# EAGLE design 20140624_empfÃ¤nger_567_frÃ¤se_v2 (EAGLE 6.4)
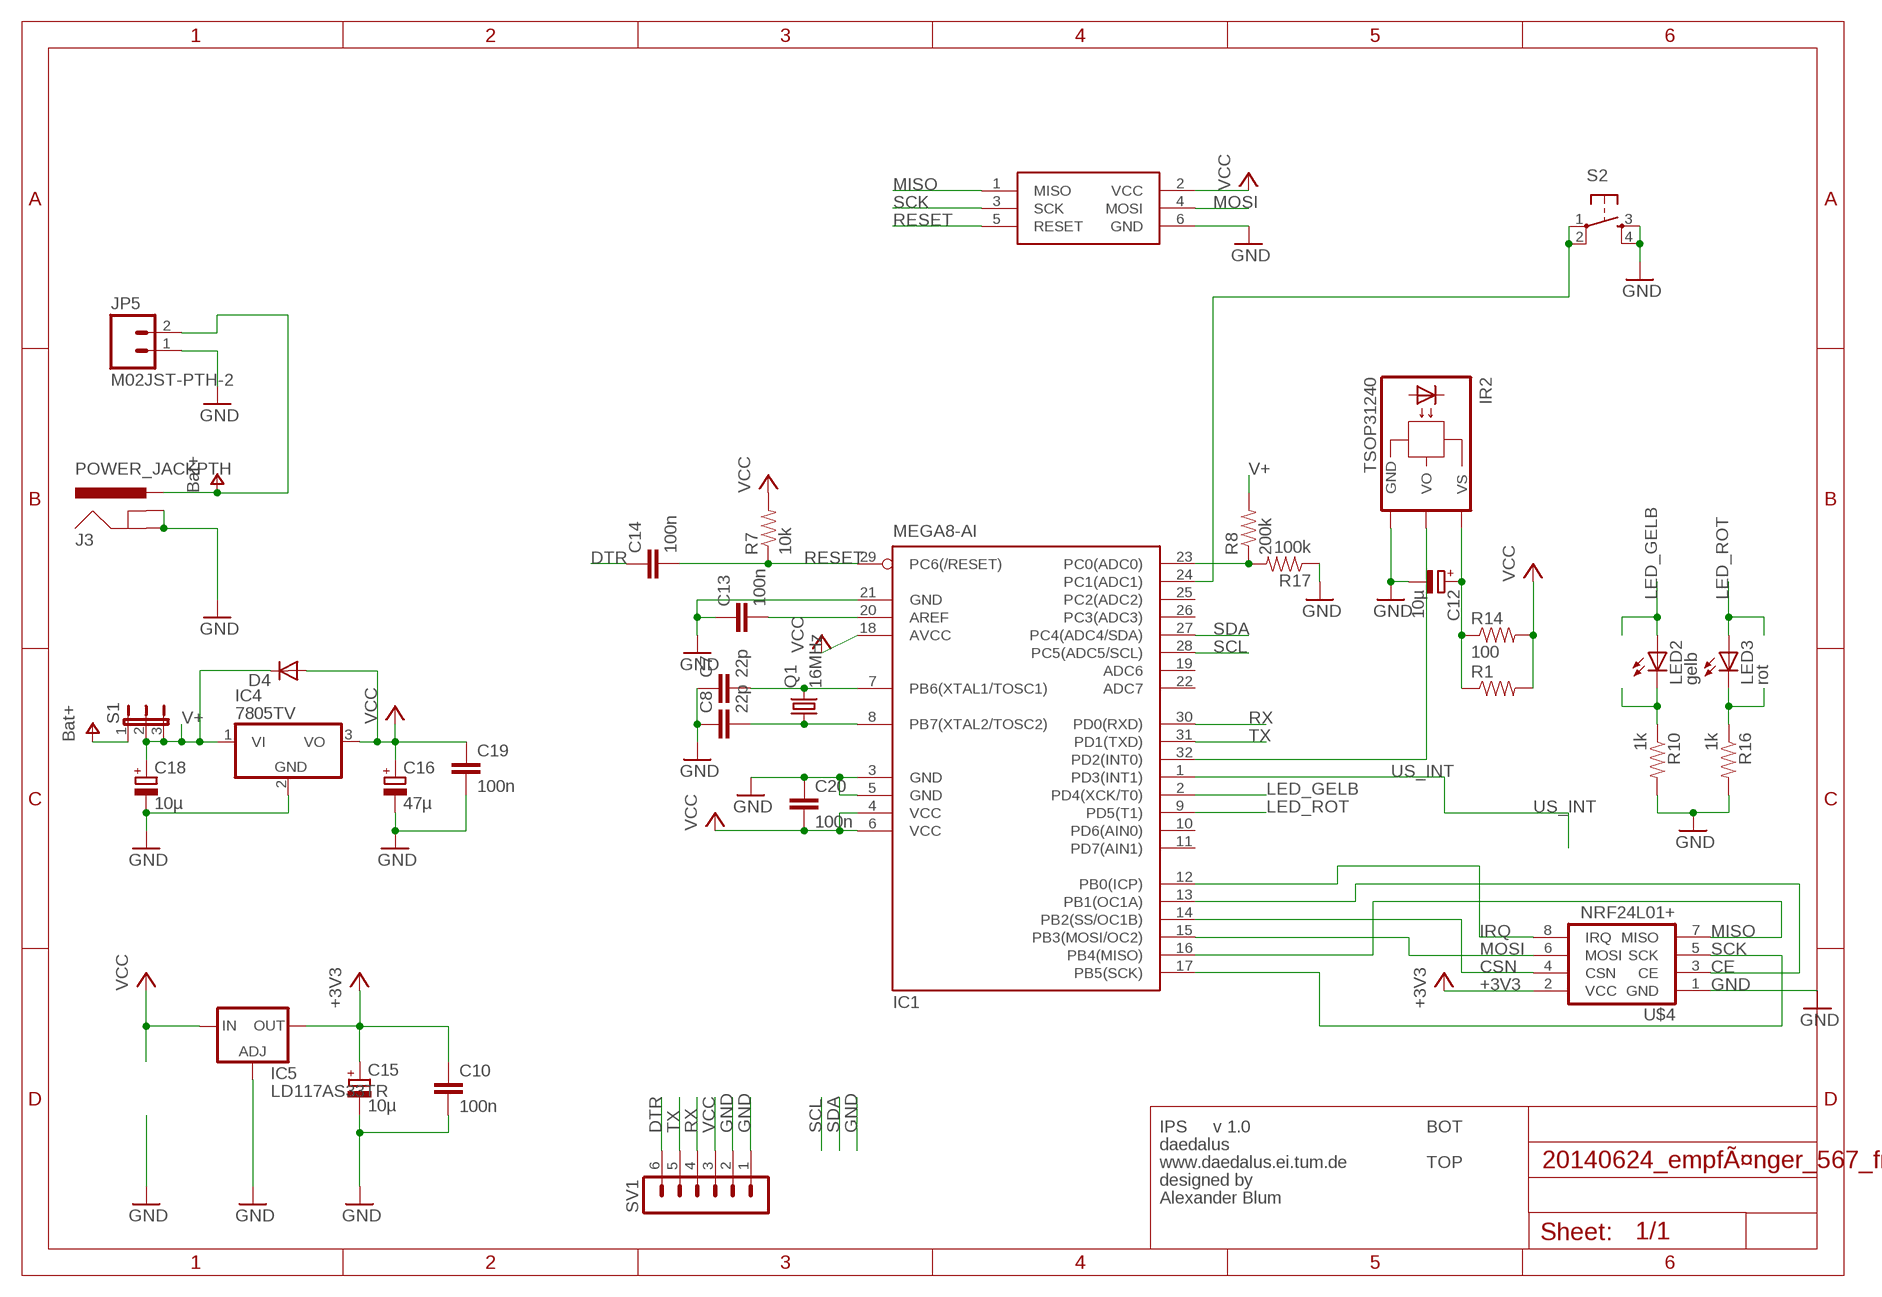
[diagram p0: schematic, sheet 1, part 1 of 2]
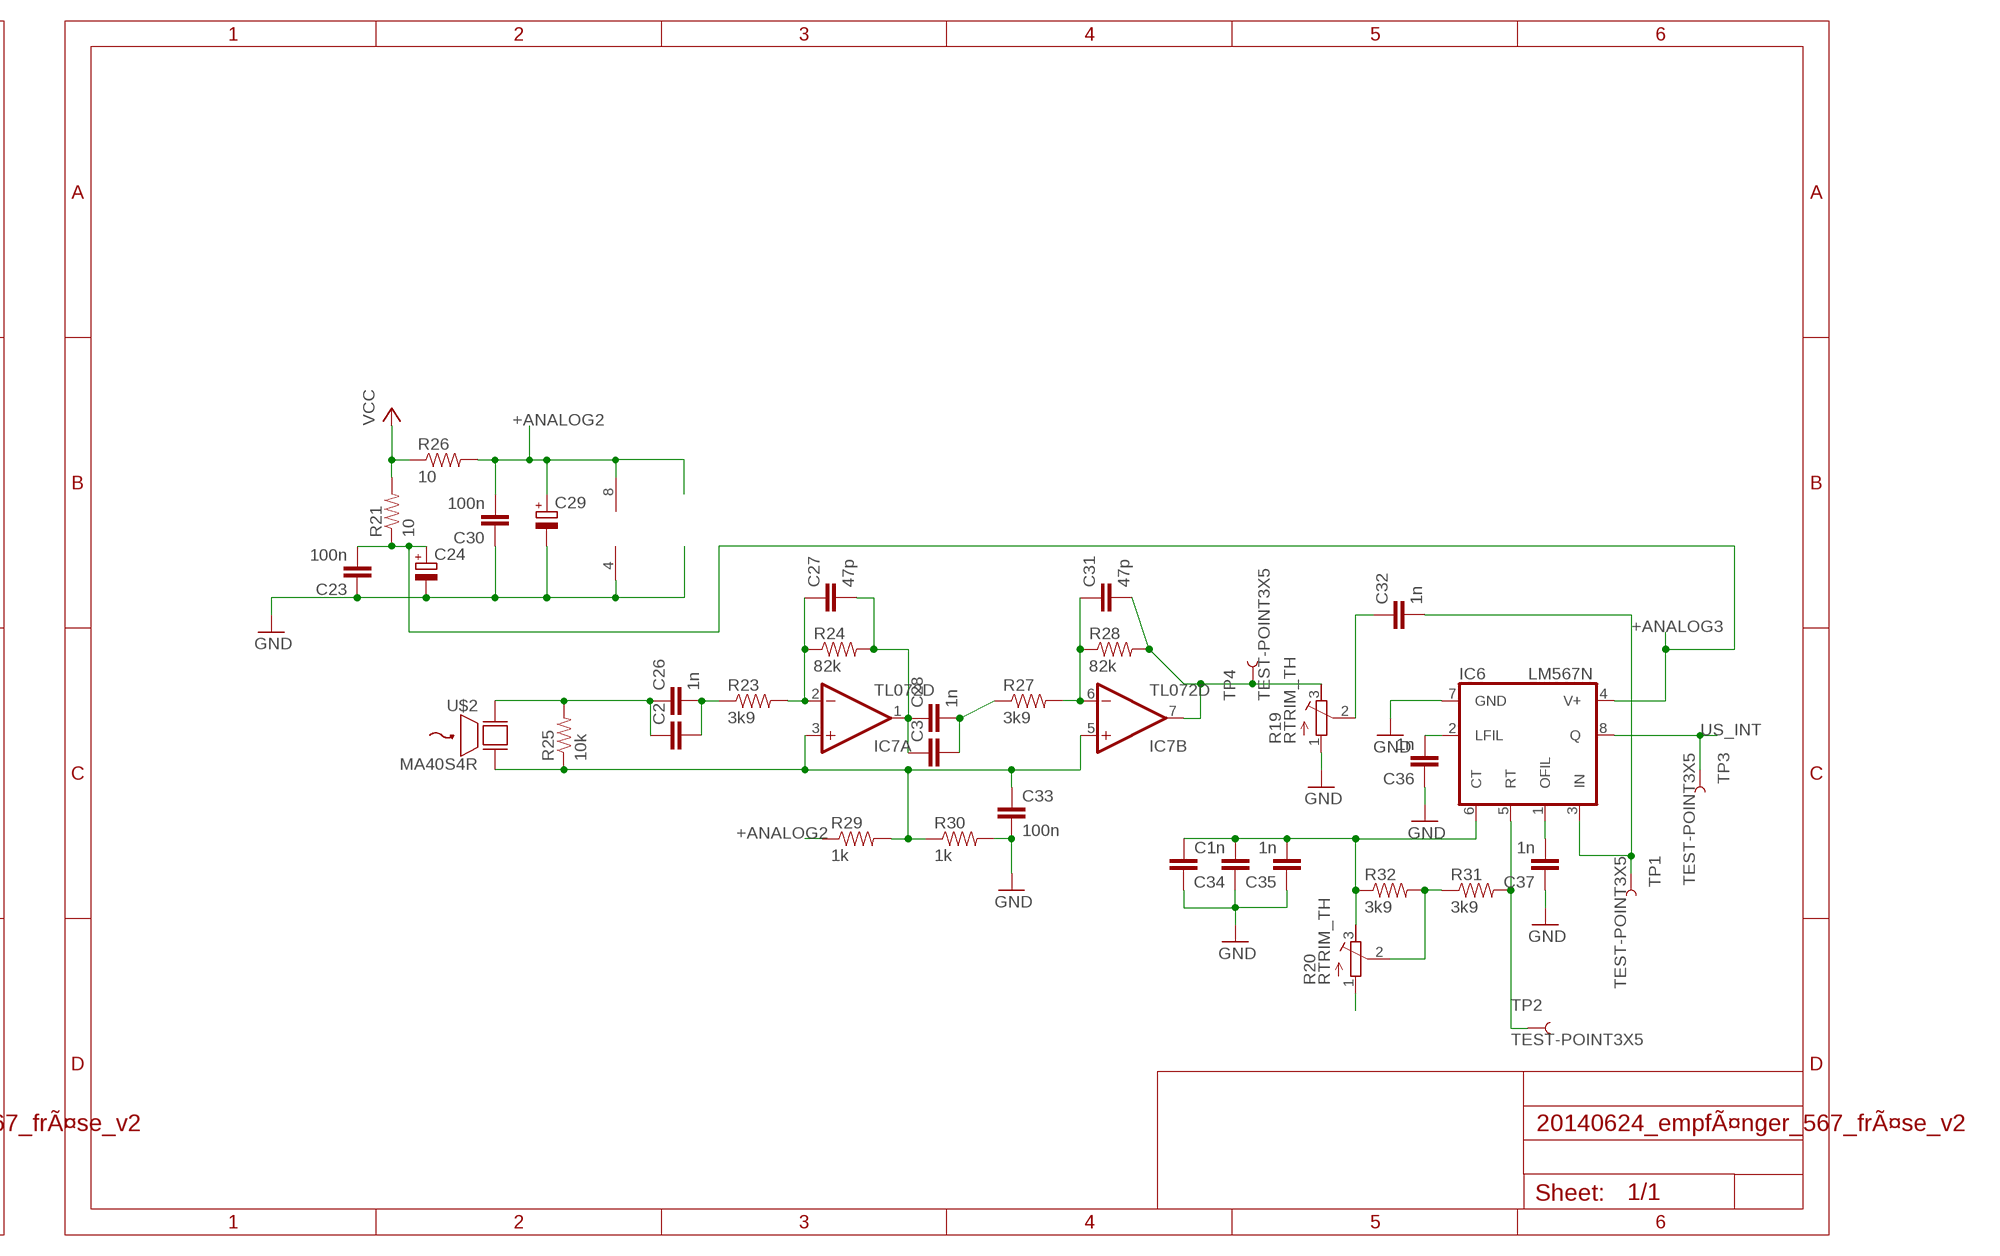
[diagram p1: schematic, sheet 1, part 2 of 2]

## Parts
C1  CAP1206  [1206]
C2  CAP1206  [1206]
C3  CAP1206  [1206]
C7  22p  CAP0805  [0805]
C8  22p  CAP0805  [0805]
C10  100n  CAP0805  [0805]
C12  10µ  CPOL-EUE2.5-5  [E2,5-5]
C13  100n  CAP0805  [0805]
C14  100n  CAP0805  [0805]
C15  10µ  CPOL-EUE2.5-5  [E2,5-5]
C16  47µ  CPOL-EUE2.5-5  [E2,5-5]
C18  10µ  CPOL-EUE2.5-5  [E2,5-5]
C19  100n  CAP0805  [0805]
C20  100n  CAP0805  [0805]
C23  100n  CAP0805  [0805]
C24  CPOL-EUE2.5-5  [E2,5-5]
C26  1n  CAP0805  [0805]
C27  47p  CAP0805  [0805]
C28  1n  CAP0805  [0805]
C29  CPOL-EUE2.5-5  [E2,5-5]
C30  100n  CAP0805  [0805]
C31  47p  CAP0805  [0805]
C32  1n  CAP0805  [0805]
C33  100n  CAP0805  [0805]
C34  1n  CAP0805  [0805]
C35  1n  CAP0805  [0805]
C36  1n  CAP0805  [0805]
C37  1n  CAP0805  [0805]
D4  DIODE-MINIMELF  [MINIMELF]
IC1  MEGA8-AI  [TQFP32-08]
IC4  7805TV  [TO220V]
IC5  LD117AS33TR  [SOT223]
IC6  LM567N  [DIL08]
IC7  TL072D  [SO08]
IR2  TSOP31240  [TSOP31240]
J3  POWER_JACKPTH  [POWER_JACK_PTH]
JP5  M02JST-PTH-2  [JST-2-PTH]
LED2  gelb  LED5MM  [LED5MM]
LED3  rot  LED5MM  [LED5MM]
Q1  16MHz  CRYSTALHC49S  [HC49/S]
R1  RESISTOR1206  [1206]
R7  10k  RESISTOR0805-RES  [0805]
R8  200k  RESISTOR0805-RES  [0805]
R10  1k  RESISTOR0805-RES  [0805]
R14  100  RESISTOR0805-RES  [0805]
R16  1k  RESISTOR0805-RES  [0805]
R17  100k  RESISTOR0805-RES  [0805]
R19  RTRIM_TH  [RTRIM_TH]
R20  RTRIM_TH  [RTRIM_TH]
R21  10  RESISTOR0805-RES  [0805]
R23  3k9  RESISTOR0805-RES  [0805]
R24  82k  RESISTOR0805-RES  [0805]
R25  10k  RESISTOR0805-RES  [0805]
R26  10  RESISTOR0805-RES  [0805]
R27  3k9  RESISTOR0805-RES  [0805]
R28  82k  RESISTOR0805-RES  [0805]
R29  1k  RESISTOR0805-RES  [0805]
R30  1k  RESISTOR0805-RES  [0805]
R31  3k9  RESISTOR0805-RES  [0805]
R32  3k9  RESISTOR0805-RES  [0805]
S1  JP2E  [JP2]
S2  TAC_SWITCHPTH  [TACTILE-PTH]
SV1  MA06-1  [MA06-1]
TP1  TEST-POINT3X5  [PAD.03X.05]
TP2  TEST-POINT3X5  [PAD.03X.05]
TP3  TEST-POINT3X5  [PAD.03X.05]
TP4  TEST-POINT3X5  [PAD.03X.05]
U$2  MA40S4R  [MUS40]
U$3  ISP_HEADER  [ISP_HEADER]
U$4  NRF24L01+  [NRF24]

## Nets
+3V3: C10.1 C15.+ IC5.4(OUT) U$4.2(VCC)
+ANALOG2: C29.+ C30.2 IC7.8(P:V+) R26.2 R29.1
+ANALOG3: C23.2 C24.+ IC6.4(V+) R21.1
BAT+: J3.PWR JP5.2 S1.1 ; supply symbol labelled Bat+
CE: IC1.13(PB1(OC1A)) U$4.3(CE)
CSN: IC1.14(PB2(SS/OC1B)) U$4.4(CSN)
DTR: C14.1 SV1.6
GND: C1.2 C7.1 C8.1 C10.2 C12.- C13.1 C15.- C16.- C18.- C19.2 C20.1 C23.1 C24.- C29.- C30.1 C33.2 C34.1 C35.1 C36.1 C37.1 IC1.3(GND) IC1.5(GND) IC1.21(GND) IC4.2(GND) IC5.1(ADJ) IC6.7(GND) IC7.4(P:V-) IR2.GND J3.GND J3.GNDBREAK JP5.1 R10.2 R16.2 R17.1 R19.1(E) R30.2 S2.3 S2.4 SV1.1 SV1.2 U$3.6(GND) U$4.1(GND)
IRQ: IC1.12(PB0(ICP)) U$4.8(IRQ)
LED_GELB: IC1.2(PD4(XCK/T0)) LED2.A
LED_ROT: IC1.9(PD5(T1)) LED3.A
MISO: IC1.16(PB4(MISO)) U$3.1(MISO) U$4.7(MISO)
MOSI: IC1.15(PB3(MOSI/OC2)) U$3.4(MOSI) U$4.6(MOSI)
N$12: C7.2 IC1.7(PB6(XTAL1/TOSC1)) Q1.2
N$14: C12.+ IR2.VS R1.1 R14.1
N$15: C8.2 IC1.8(PB7(XTAL2/TOSC2)) Q1.1
N$16: IC1.23(PC0(ADC0)) R8.1 R17.2
N$18: IC1.32(PD2(INT0)) IR2.VO
N$20: R20.2(S) R31.1 R32.2
N$21: C13.2 IC1.20(AREF)
N$26: LED2.K(C) R10.1
N$27: LED3.K(C) R16.1
N$32: C2.2 C26.2 R23.1
N$33: C27.1 IC7.2(A:-IN) R23.2 R24.1
N$34: C3.1 C27.2 C28.1 IC7.1(A:OUT) R24.2
N$35: C3.2 C28.2 R27.1
N$36: C2.1 C26.1 R25.2 U$2.2
N$37: IC6.5(RT) R31.2 TP2.P$1
N$39: C33.1 IC7.3(A:+IN) IC7.5(B:+IN) R25.1 R29.2 R30.1 U$2.1
N$40: IC1.24(PC1(ADC1)) S2.1 S2.2
N$41: C31.1 IC7.6(B:-IN) R27.2 R28.1
N$43: C1.1 C34.2 C35.2 IC6.6(CT) R20.3(A) R32.1
N$44: C31.2 IC7.7(B:OUT) R19.3(A) R28.2 TP4.P$1
N$45: C32.1 R19.2(S)
N$46: C32.2 IC6.3(IN) TP1.P$1
N$47: C37.2 IC6.1(OFIL)
N$49: C36.2 IC6.2(LFIL)
N$65: R20.1(E)
RESET: C14.2 IC1.29(PC6(/RESET)) R7.1 U$3.5(RESET)
RX: IC1.30(PD0(RXD)) SV1.4
SCK: IC1.17(PB5(SCK)) U$3.3(SCK) U$4.5(SCK)
SCL: IC1.28(PC5(ADC5/SCL))
SDA: IC1.27(PC4(ADC4/SDA))
TX: IC1.31(PD1(TXD)) SV1.5
US_INT: IC1.1(PD3(INT1)) IC6.8(Q) TP3.P$1
V+: C18.+ D4.C IC4.1(VI) R8.2 S1.2 S1.3
VCC: C16.+ C19.1 C20.2 D4.A IC1.4(VCC) IC1.6(VCC) IC1.18(AVCC) IC4.3(VO) IC5.3(IN) R1.2 R7.2 R14.2 R21.2 R26.1 SV1.3 U$3.2(VCC)
Unconnected: IC1.10(PD6(AIN0)) IC1.11(PD7(AIN1)) IC1.19(ADC6) IC1.22(ADC7) IC1.25(PC2(ADC2)) IC1.26(PC3(ADC3))

## Notes on the sheet
- IPS | v 1.0 | BOT
- daedalus
- www.daedalus.ei.tum.de | TOP
- designed by
- Alexander Blum

## Library data of the parts
C1-C3 C7 C8 C10 C13 C14 C19 C20 C23 C26-C28 C30-C37 = SparkFun-Passives:CAP: Capacitor Standard 0603 ceramic capacitor, and 0.1" leaded capacitor.
C12 C15 C16 C18 C24 C29 = resistor:CPOL-EU: POLARIZED CAPACITOR, European symbol
D4 = diode:DIODE-: DIODE
IC1 = atmel:MEGA8: MICROCONTROLLER 8 Kbytes FLASH, 1 kbytes SRAM, 512 bytes EEPROM, USART, 6-channel 10 bit ADC, 2-channel 8 bit ADC Pin compatible with Atmega48, ATMega88, ATMega168 Source: avr.lbr; MPN: ATMEGA8-16AU; OC_FARNELL: 9171371; OC_NEWARK: 73M8863
IC4 = linear:78*: Positive VOLTAGE REGULATOR Source: http://cache.national.com/ds/LM/LM78L05.pdf http://www.fairchildsemi.com/ds/LM/LM7805.pdf
IC5 = v-reg:LD117A?*: Low drop fixed and adjustable positive voltage regulators 1 A Source: http://www.st.com/stonline/products/literature/ds/7194/ld1117axx.pdf
IC6 = linear:*567: TONE DECODER
IC7 = linear:TL072: OP AMP
IR2 = Alex_daedalus_ips:TSOP312: TSOP17..TB1 IR Receiver Modules for Remote Control Systems Source: http://www.vishay.com/docs/82042/82042.pdf; OC_FARNELL: unknown; OC_NEWARK: unknown
J3 = SparkFun-Connectors:POWER_JACK: Power Jack This is the standard 5.5mm barrel jack for power. The PTH is the most common, proven, reliable, footprint. The Slot footprint only works if the mill layer is transmitted to the PCB fab house so be warned. Mating wall wart : TOL-00298 (and others); PROD_ID: PRT-00119
JP5 = SparkFun-Connectors:M02: Standard 2-pin 0.1" header. Use with - straight break away headers ( PRT-00116) - right angle break away headers (PRT-00553) - swiss pins (PRT-00743) - machine pins (PRT-00117) - female headers (PRT-00115) Molex polarized connector foot print use with: PRT-08233 with associated crimp pins and housings. 2.54_SCREWTERM for use with PRT-10571. 3.5mm Screw Terminal footprints for PRT-08084 5mm Screw Terminal footprints for use with PRT-08433; SKU: PRT-09914
LED2 LED3 = led:LED: LED OSRAM: - CHIPLED LG R971, LG N971, LY N971, LG Q971, LY Q971, LO R971, LY R971 LH N974, LH R974 LS Q976, LO Q976, LY Q976 LO Q996 - Hyper CHIPLED LW Q18S LB Q993, LB Q99A, LB R99A - SideLED LS A670, LO A670, LY A670, LG A670, LP A670 LB A673, LV A673, LT A673, LW A673 LH A674 LY A675 LS A676, LA A676, LO A676, LY A676, LW A676 LS A679, LY A679, LG A679 - Hyper Micro SIDELED® LS Y876, LA Y876, LO Y876, LY Y876 LT Y87S - SmartLED LW L88C, LW L88S LB L89C, LB L89S, LG L890 LS L89K, LO L89K, LY L89K LS L896, LA L896, LO L896, LY L896 - TOPLED LS T670, LO T670, LY T670, LG T670, LP T670 LSG T670, LSP T670, LSY T670, LOP T670, LYG T670 LG T671, LOG T671, LSG T671 LB T673, LV T673, LT T673, LW T673 LH T674 LS T676, LA T676, LO T676, LY T676, LB T676, LH T676, LSB T676, LW T676 LB T67C, LV T67C, LT T67C, LS T67K, LO T67K, LY T67K, LW E67C LS E67B, LA E67B, LO E67B, LY E67B, LB E67C, LV E67C, LT E67C LW T67C LS T679, LY T679, LG T679 LS T770, LO T770, LY T770, LG T770, LP T770 LB T773, LV T773, LT T773, LW T773 LH T774 LS E675, LA E675, LY E675, LS T675 LS T776, LA T776, LO T776, LY T776, LB T776 LHGB T686 LT T68C, LB T68C - Hyper Mini TOPLED® LB M676 - Mini TOPLED Santana® LG M470 LS M47K, LO M47K, LY M47K Source: http://www.osram.convergy.de LUXEON: - LUMILED® LXK2-PW12-R00, LXK2-PW12-S00, LXK2-PW14-U00, LXK2-PW14-V00 LXK2-PM12-R00, LXK2-PM12-S00, LXK2-PM14-U00 LXK2-PE12-Q00, LXK2-PE12-R00, LXK2-PE12-S00, LXK2-PE14-T00, LXK2-PE14-U00 LXK2-PB12-K00, LXK2-PB12-L00, LXK2-PB12-M00, LXK2-PB14-N00, LXK2-PB14-P00, LXK2-PB14-Q00 LXK2-PR12-L00, LXK2-PR12-M00, LXK2-PR14-Q00, LXK2-PR14-R00 LXK2-PD12-Q00, LXK2-PD12-R00, LXK2-PD12-S00 LXK2-PH12-R00, LXK2-PH12-S00 LXK2-PL12-P00, LXK2-PL12-Q00, LXK2-PL12-R00 Source: www.luxeon.com KINGBRIGHT: KA-3528ASYC Source: www.kingbright.com
Q1 = crystal:CRYSTAL: CRYSTAL; OC_FARNELL: 1667008; OC_NEWARK: unknown
R1 R7 R8 R10 R14 R16 R17 R21 R23-R32 = SparkFun-Passives:RESISTOR: Resistor Basic schematic elements and footprints for 0603, 1206, and PTH resistors.
R19 R20 = Alex_daedalus_ips:RTRIM_TH
S1 = jumper:JP2E: JUMPER
S2 = SparkFun-Electromechanical:TAC_SWITCH: Momentary Switch Button commonly used for reset or general input. Spark Fun Electronics SKU : COM-00097 SMT- SWCH-08247
SV1 = con-lstb:MA06-1: PIN HEADER; OC_FARNELL: unknown; OC_NEWARK: unknown
TP1-TP4 = SparkFun-Passives:TEST-POINT: Bare copper test points for troubleshooting or ICT
U$2 = Alex_daedalus_ips:MA40S4R
U$3 = Alex_daedalus_ips:ISP_HEADER
U$4 = Alex_daedalus_ips:NRF24L01+

## Board
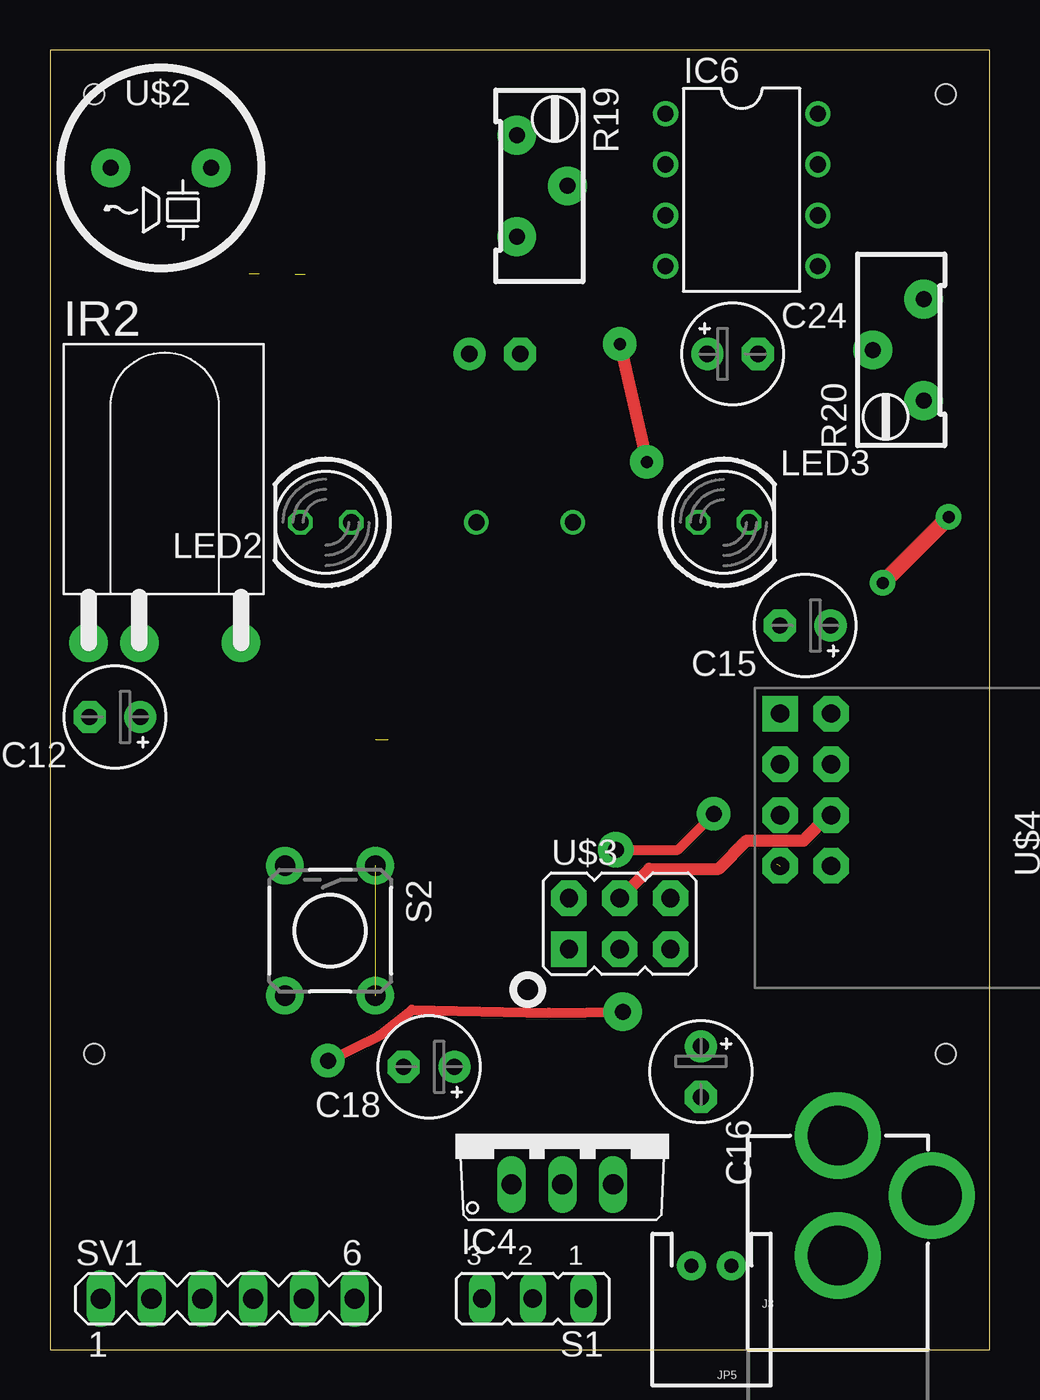
[diagram p2: board, top side]
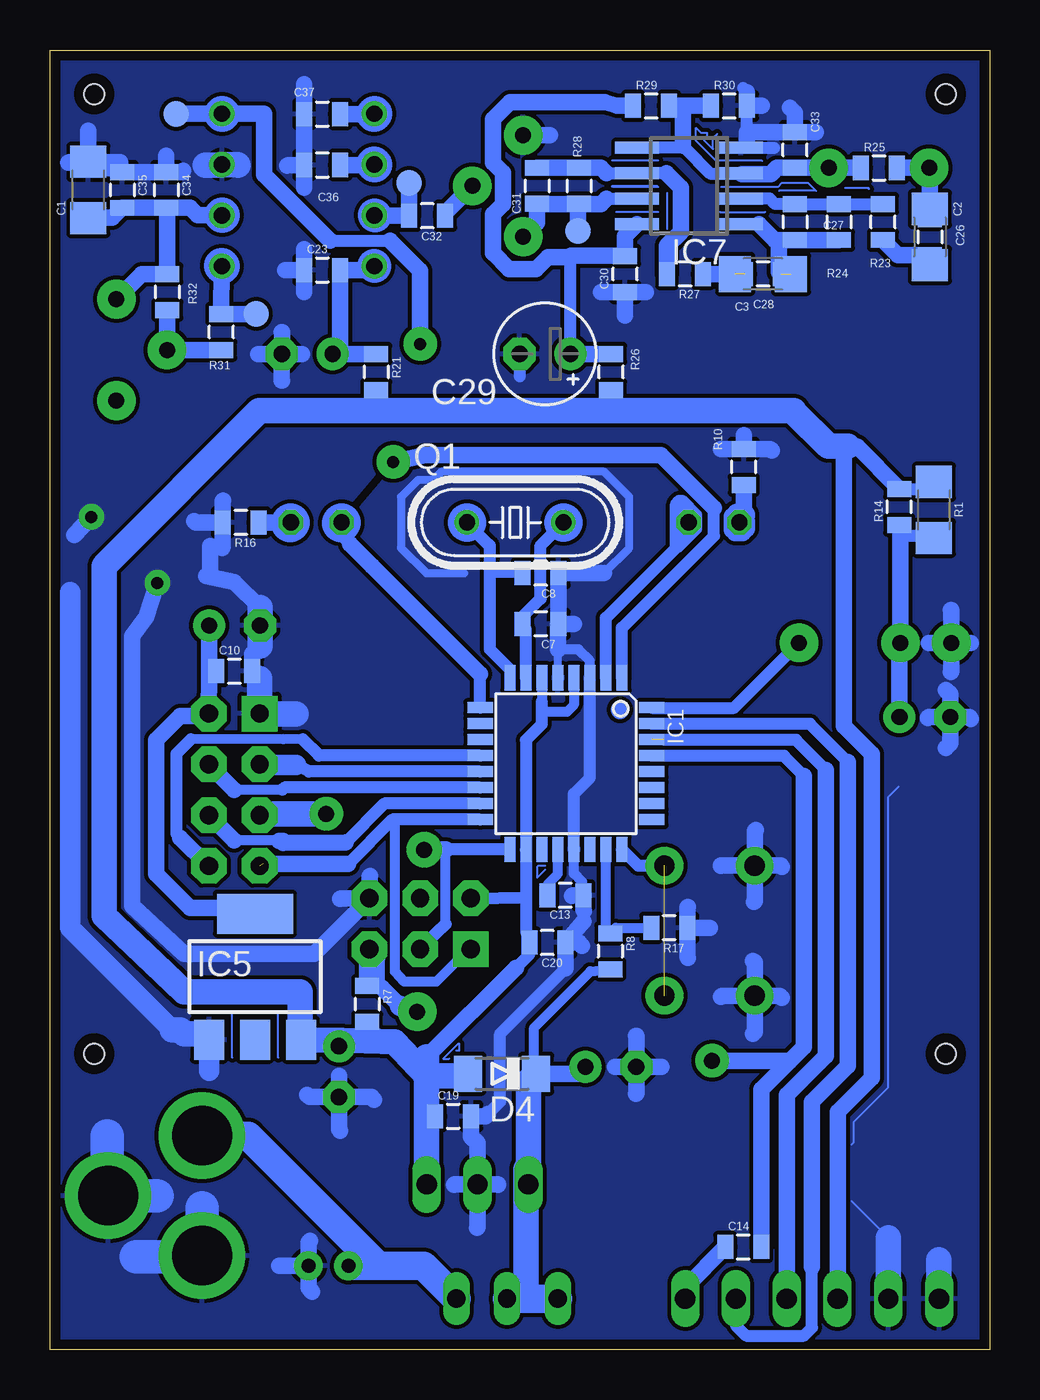
[diagram p3: board, bottom side, seen from below]

Size 47 x 65 mm. Coordinates in mm from the lower left corner, seen from the top.
Outline: 0,0 47,0 47,65 0,65 0,0
Copper layers (1*16): Top 0.07mm / dielectric 1.5mm / Bottom 0.07mm
Design rules "multi-cb_070um-cu *": minimum track width 8mil, minimum drill 12mil, track to track 4mil, track to pad 8mil, pad to pad 8mil, via to via 8mil, smd to smd 8mil, copper to edge 20mil, drill to drill 8mil, minimum pad ring 8mil, minimum via ring 6mil, stop-mask expansion 3mil, vias tented up to drill 0mil, thermal gap 8mil
Holes 1 mm at 2.2,62.8 44.8,62.8 44.8,14.8 2.2,14.8
bRestrict: 2 lines

### Footprints (pad centres in the part's own frame; a part is rotated, then mirrored left to right if it is on the bottom)
1206 = smd 1.6 x 1.8: 1 -1.4,0; 2 1.4,0
0805 = smd 0.8 x 1.2: 1 -0.9,0; 2 0.9,0
E2,5-5 = drill 0.813 pad 1.6: + -1.27,0 | drill 0.813 pad 1.6 octagon: - 1.27,0
MINIMELF = smd 1.4 x 1.8: A 1.7,0; C -1.7,0
TQFP32-08 = smd 1.27 x 0.559: 1 -4.293,2.8; 2 -4.293,2; 3 -4.293,1.2; 4 -4.293,0.4; 5 -4.293,-0.4; 6 -4.293,-1.2; 7 -4.293,-2; 8 -4.293,-2.8; 17 4.293,-2.8; 18 4.293,-2; 19 4.293,-1.2; 20 4.293,-0.4; 21 4.293,0.4; 22 4.293,1.2; 23 4.293,2; 24 4.293,2.8 | smd 0.559 x 1.27: 9 -2.8,-4.293; 10 -2,-4.293; 11 -1.2,-4.293; 12 -0.4,-4.293; 13 0.4,-4.293; 14 1.2,-4.293; 15 2,-4.293; 16 2.8,-4.293; 25 2.8,4.293; 26 2,4.293; 27 1.2,4.293; 28 0.4,4.293; 29 -0.4,4.293; 30 -1.2,4.293; 31 -2,4.293; 32 -2.8,4.293
TO220V = drill 1.016 long: 1 -2.54,-2.54; 2 0,-2.54; 3 2.54,-2.54
SOT223 = smd 1.5 x 2: 1 -2.3,-3.15; 2 0,-3.15; 3 2.3,-3.15 | smd 3.8 x 2: 4 0,3.15
DIL08 = drill 0.813 pad 1.27: 1 -3.81,-3.81; 2 -1.27,-3.81; 3 1.27,-3.81; 4 3.81,-3.81; 5 3.81,3.81; 6 1.27,3.81; 7 -1.27,3.81; 8 -3.81,3.81
SO08 = smd 0.6 x 2.2: 1 -1.905,-2.6; 2 -0.635,-2.6; 3 0.635,-2.6; 4 1.905,-2.6; 5 1.905,2.6; 6 0.635,2.6; 7 -0.635,2.6; 8 -1.905,2.6
TSOP31240 = drill 0.8 pad 1.93: GND 2.54,1.27; VO 10.16,1.27; VS 5.08,1.27
POWER_JACK_PTH = drill 2.997 pad 4.318: GND 0,7.7; GNDBREAK 4.7,10.7; PWR 0,13.7
JST-2-PTH = drill 0.7 pad 1.448: 1 -1,0; 2 1,0
LED5MM = drill 0.813 octagon: A -1.27,0; K 1.27,0
HC49/S = drill 0.813: 1 -2.413,0; 2 2.413,0
RTRIM_TH = drill 0.8 pad 1.93: 1 0,-2.54; 2 -2.54,0; 3 0,2.54
JP2 = drill 0.914 long: 1 -2.54,0; 2 0,0; 3 2.54,0
TACTILE-PTH = drill 1.016 pad 1.88: 1 -3.251,2.261; 2 3.251,2.261; 3 -3.251,-2.261; 4 3.251,-2.261
MA06-1 = drill 1.016 long: 1 -6.35,0; 2 -3.81,0; 3 -1.27,0; 4 1.27,0; 5 3.81,0; 6 6.35,0
PAD.03X.05 = smd 1.27 x 1.27: P$1 0,0
MUS40 = drill 0.8 pad 1.93: 1 -2.513,0; 2 2.513,0
ISP_HEADER = drill 0.914 pad 1.778 square: 1 -2.54,-1.27 | drill 0.914 pad 1.778 octagon: 2 -2.54,1.27; 3 0,-1.27; 4 0,1.27; 5 2.54,-1.27; 6 2.54,1.27
NRF24 = drill 0.914 pad 1.778 square: 1 -3.81,-1.27 | drill 0.914 pad 1.778 octagon: 2 -3.81,1.27; 3 -1.27,-1.27; 4 -1.27,1.27; 5 1.27,-1.27; 6 1.27,1.27; 7 3.81,-1.27; 8 3.81,1.27

### Placement (x,y rotation side)
C1  45.1,58 90 bottom
C2  3,55.65 270 bottom
C3  11.35,53.8 180 bottom
C7  22.48,36.29 180 bottom
C8  22.48,38.83 180 bottom
C10  37.8,33.93 0 bottom
C12  3.25,31.64 180 top
C13  21.23,22.72 180 bottom
C14  12.33,5.13 0 bottom
C15  37.78,36.21 180 top
C16  32.56,13.9 270 top
C18  18.96,14.14 180 top
C19  26.85,11.67 0 bottom
C20  22.14,20.36 180 bottom
C23  33.4,54 0 bottom
C24  34.15,49.8 0 top
C26  3,55.65 270 bottom
C27  7.55,56.4 270 bottom
C28  11.35,53.8 180 bottom
C29  22.25,49.8 180 bottom
C30  18.25,53.8 90 bottom
C31  22.65,58.2 270 bottom
C32  28.15,56.7 180 bottom
C33  9.75,60 90 bottom
C34  41.2,58 270 bottom
C35  43.4,58 270 bottom
C36  33.4,59.25 0 bottom
C37  33.4,61.8 0 bottom
D4  24.4,13.8 180 bottom
IC1  21.2,29.3 270 bottom
IC4  25.63,10.8 0 top
IC5  36.76,18.65 0 bottom
IC6  34.6,58 270 top
IC7  15.05,58.2 90 bottom
IR2  -0.61,34.08 0 top
J3  39.41,-3 0 top
JP5  33.09,4.19 180 top
LED2  13.8,41.37 180 top
LED3  33.7,41.37 0 top
Q1  23.75,41.37 0 bottom
R1  2.8,42 90 bottom
R7  31.14,17.28 270 bottom
R8  18.99,19.92 270 bottom
R10  12.31,44.15 90 bottom
R14  4.53,42.15 90 bottom
R16  37.47,41.37 180 bottom
R17  16.03,21.09 180 bottom
R19  23.35,58.2 180 top
R20  43.7,50 0 top
R21  30.7,48.9 270 bottom
R23  5.35,56.4 90 bottom
R24  9.75,56.4 270 bottom
R25  5.55,59.1 0 bottom
R26  18.95,48.9 90 bottom
R27  15.25,53.8 180 bottom
R28  20.55,58.2 270 bottom
R29  16.95,62.2 0 bottom
R30  13.05,62.2 0 bottom
R31  38.45,50.9 90 bottom
R32  41.15,52.9 270 bottom
S1  24.15,2.55 180 top
S2  14.02,20.95 270 top
SV1  8.89,2.54 0 top
TP1  29.05,58.35 180 bottom
TP2  36.7,51.8 90 bottom
TP3  40.7,61.8 90 bottom
TP4  20.6,55.95 0 bottom
U$2  5.55,59.1 180 top
U$3  28.5,21.3 0 top
U$4  37.8,28 270 top

### Tracks (layer width: path | path; a pad name or v marks a point on that pad's centre or on a via)
+3V3
  Bottom 0.1: C10.1 38.95,33.93 39.05,33.83
  Bottom 0.813: IC5.4 38.36,22.1 40,22.1 41.7,23.8 41.7,30.5 40.5,31.7 39.12,31.7 U$4.2 | U$4.2 39.05,31.77 | C15.+ 39.05,33.83 U$4.2
+ANALOG2
  Bottom 0.61: 21.04,50.24 C29.+ 20.98,54.67 | 20.98,54.67 20.95,54.7 | 21,54.65 20.98,54.67
  Bottom 0.813: IC7.8 18.25,55.7 C30.2 20.95,54.7 | R29.1 18.65,62.2 19.25,62.4 24,62.4 24.85,61.55 24.85,59.35 24.35,58.85 24.35,57.3 24.85,56.8 24.85,54.85 24.05,54.05 22.7,54.05 22.1,54.65 21,54.65 | R26.2 C29.+
+ANALOG3
  Bottom 0.813: R21.1 C24.+ 32.5,50.18 C23.2 30.98,54 IC6.4
  Bottom 1.676: IC6.4
BAT+
  Bottom 1.422: J3.PWR 37.1,10.7 30.75,4.35 30.75,4.19 | JP5.2 30.75,4.19 | 30.75,4.19 28.32,4.19 S1.1
CE
  Bottom 0.61: IC1.13 34.05,28.91 34.7,29.25
  Bottom 1.016: 34.7,29.25 36.51,29.25 U$4.3
CSN
  Bottom 0.49: 35.4,28 37.8,28
  Bottom 0.61: IC1.14 35.3,28.11 35.4,28
  Bottom 0.813: 37.8,28 U$4.4
DTR
  Bottom 0.813: 15.28,2.58 SV1.6 15.24,3.12 C14.1
GND  (via drill 0.6 pad 1.27)
  Top 0.813: v41.65,38.35 v44.95,41.65
  Bottom 0.1: 5.08,5.59 6.91,7.42 | 6.91,10.26 6.81,10.36 6.81,11.38 5.08,13.11 5.08,27.64 4.57,28.14
  Bottom 0.406: IC1.5 21.61,35.02 | 19.3,38.83 18.03,40.1 18.03,42.64 19.3,43.91 27.44,43.91 27.85,43.5 28.6,43.5 29.46,42.64 29.46,40.1 28.19,38.83 26.29,38.83
  Bottom 0.508: IC1.3 20,34.45 20.57,35.02 21.61,35.02 | C13.1 20.4,22.79 20.4,23.4 20.8,23.8 IC1.21 | C36.1 C37.1
  Bottom 0.61: 12.15,60.41 IC7.4 10.8,60.1 | IC1.21 20.8,27.8 20,28.59 IC1.3 | 21.61,36.16 21.57,36.19 C7.1 | 25.1,11.8 24.5,12.4 24.5,15.8 21.23,19.07 | C29.- 23.52,48.67 | C35.1 43.45,58.95 44.5,58.95 | 12.15,62.9 12.35,63.1 | 12.15,60.9 R30.2
  Bottom 0.813: 19.3,38.83 C8.1 C7.1 | 12.15,60.41 12.15,60.9 C33.2 | 20.33,21.41 C20.1 | 39,40.2 39,38.9 39.2,38.7 37.8,38.4 36.51,37.11 | v41.65,38.35 42.2,36.65 42.9,35.7 42.9,22.2 40.3,19.8 33.81,19.8 U$3.6 | v44.95,41.65 45.8,40.75 | R10.2 | R19.1 22,60.75 | 10,62.1 9.75,61.85 C33.2 | C33.2 8.7,60.9 | 11.4,62.2 R30.2 12.15,62.9 | C30.1 18.25,51.7 | C30.1 19.45,52.9 | C30.1 17.2,52.9 | C36.1 34.3,58.1 | C36.1 35.1,59.25 35.15,59.2 | C36.1 34.3,63.3 | C34.1 40.4,58.9 40.35,58.95 | C34.1 41.2,59.7 | C34.1 C35.1 | C1.2 45.1,60.95 | C1.2 46.05,59.4 46.1,59.35 | C23.1 35.25,54 | C23.1 34.3,55.05 | C23.1 34.3,52.9 | C1.2 43.5,59.4 | C24.- 36.6,49.8 | C24.- 35.42,48.47 35.4,48.45 | 35.42,50.88 35.4,50.9 35.4,49.82 C24.- | C24.- 34.4,49.8 | R10.2 13.45,45.05 | 10.9,44.95 11,45.05 R10.2 | R10.2 12.31,45.74 12.3,45.75 | C7.1 20.81,36.29 20.8,36.3 | 21.61,35.02 21.61,36.26 C7.1 | R16.2 38.37,42.43 38.35,42.45 | R16.2 39.72,41.37 39.8,41.45 | R16.2 38.37,40.13 38.4,40.1 | C10.2 36.9,34.8 36.51,35.19 | U$3.6 31.04,23.66 31,23.7 | U$3.6 32.48,22.57 32.5,22.55 | 25.1,11.8 25.23,11.67 C19.2 25.95,10.65 25.63,10.33 IC4.2 | IC4.2 24.61,8.26 24.6,8.25 | IC4.2 26.79,8.26 26.8,8.25 | IC4.2 25.63,6.12 25.65,6.1 | 20.9,22.7 20.88,22.72 C13.1 20.33,21.98 20.3,21.95 | 17.7,12.8 17.69,12.81 C18.- 17.69,15.69 17.7,15.7 | R17.1 15.13,22.12 15.1,22.15 | R17.1 15.13,19.63 15.1,19.6 | R17.1 14.01,21.09 14,21.1 | 11.7,26 11.76,25.94 S2.3 | S2.3 13.45,24.2 | S2.3 11.76,22.44 11.8,22.4 | 11.85,19.45 11.76,19.36 S2.4 | 11.85,15.8 11.76,15.89 S2.4 | S2.4 13.4,17.7 13.45,17.65 | S2.3 10.45,24.2 10.4,24.15 | S2.4 10.5,17.7 10.4,17.6 | 16.44,14.14 18.74,14.14 18.75,14.15 | 34.15,12.75 34.03,12.63 C16.-
  Bottom 0.813: 30.8,12.5 30.93,12.63 C16.- | C16.- 32.56,11.01 32.5,10.95 | C16.- 32.56,13.69 32.55,13.7 | JP5.1 34.09,3.09 33.9,2.9 | 34,5.45 34.09,5.36 JP5.1 | JP5.1 35.54,4.19 35.55,4.2 | C12.- 1.04,31.64 0.95,31.55 | C12.- 1.98,32.78 2.2,33 | 2.2,30.1 1.98,30.32 C12.- | C12.- 3.06,31.64 3.1,31.6 | IR2.GND 1.93,36.98 1.95,37 | IR2.GND 3.05,35.35 | IR2.GND 0.95,35.35 | IR2.GND 1.93,33.92 1.95,33.9 | C20.1 20.56,20.36 20.4,20.2 | C20.1 21.23,19.07
  Bottom 1.016: 40.9,16 46,21.1 46,37.9 | IC5.1 39.06,13.96 39.05,13.95
  Bottom 1.27: 36.51,37.11 C15.- 36.51,35.19 | IC5.1 39.36,15.8 40.3,15.8 40.5,16 40.9,16 | SV1.1 2.55,4.5 | SV1.2 5.08,5.59 | 34.7,31.8 U$4.1 36.53,33.57 | 39.25,59.25 38.43,59.25 IC6.7 37.62,59.27 37.6,59.25
  Bottom 1.676: 39.4,7.1 39.4,4.71 J3.GND 39.46,4.65 42.7,4.65 | 44.15,10.7 44.15,7.74 J3.GNDBREAK 41.65,7.7
  pour Bottom (isolate 0.2): 0,0 0,65 47,65 47,0
IRQ
  Bottom 0.48: 35.35,30.53 39.96,30.53
  Bottom 0.508: 40.7,25.8 40.5,25.6 | 34.37,30.52 35.35,30.53
  Bottom 0.61: 39.96,30.53 40.7,29.8 40.7,25.8 | IC1.12 33.55,29.7 34.37,30.52
  Bottom 0.813: 40.5,25.6 U$4.8
LED_GELB
  Bottom 0.61: IC1.2 19.2,36.59 15.7,40.1 15.7,42.3 15.55,42.45 15.4,42.45 14.7,41.75 14.7,41.05 15.6,40.15 15.6,42.1 15.25,42.1 15.15,42 15.15,40.95 15.4,40.7 15.4,41.04 LED2.A
LED_ROT
  Bottom 0.61: IC1.9 25.5,33.8 | 32.3,40.59 32,40.3 32.45,40.74 32.45,41.35
  Bottom 0.813: 25.5,33.8 30.9,39.2 32,40.3
  Bottom 1.93: LED3.A 32.45,41.35
MISO  (1 unrouted)
  Bottom 0.49: 29.76,18.9 29.76,26.43
  Bottom 0.508: U$3.1 26.04,20.06 27.7,18.4 29.3,18.4 29.76,18.9 | 29.76,26.43 29.89,26.5
  Bottom 0.61: IC1.16 29.89,26.5 32.1,24.3
  Bottom 0.813: 32.1,24.3 36.36,24.3
MOSI
  Top 0.61: U$3.4 29.98,24.05 33.45,24.05 34.86,25.46 37.7,25.46 38.97,26.73 U$4.6
  Bottom 0.49: 35.61,25.46 37.8,25.46
  Bottom 0.5: 35.55,25.45 35.61,25.46
  Bottom 0.61: IC1.15 30.3,27.3 32.24,25.36
  Bottom 0.813: 32.24,25.36 35.35,25.35 35.35,25.45 35.55,25.45 | 37.8,25.46 U$4.6
N$1
  pour Bottom: 13,7.15 13,10.9 14,11.6 19.1,11.6 20.1,10.6 20.1,7.35 19.55,6.8 13.65,6.8
N$12
  Bottom 0.508: 22.48,40.23 22.45,40.25
  Bottom 0.61: IC1.7 23.2,36.02 C7.2 23.48,36.56 22.48,37.56 22.48,40.23 | 22.45,40.25 Q1.2
  Bottom 1.93: Q1.2
N$14
  Bottom 0.61: R1.1 2.9,40.7 4.47,40.7
  Bottom 0.813: C12.+ 4.52,35.3 IR2.VS 4.47,40.7 4.47,41.19 R14.1
N$15
  Bottom 0.406: IC1.8 24,34.01
  Bottom 0.508: C8.2 24.95,38.83 25.02,38.9 | 25.02,40.23 25.04,40.25 25.05,40.25
  Bottom 0.61: 24,34.01 25.02,35.02 25.02,38.9 25.02,40.23 | 25.05,40.25 26.16,41.36
  Bottom 1.93: Q1.1 26.16,41.36
N$16
  Bottom 0.508: IC1.23 19.2,21.04 R8.1 18.72,21.09 R17.2
N$18
  Bottom 0.61: IC1.32 12.8,32.1 IR2.VO
N$20
  Bottom 0.813: R31.1 R20.2 R32.2
N$21
  Bottom 0.508: C13.2 22.1,22.75 22.1,23.3 21.61,23.8 IC1.20
N$26
  Bottom 0.813: R10.1 12.31,41.59 12.15,41.43 12.15,41.05 12.35,40.85 12.75,40.85 12.9,41 12.9,41.7 12.7,41.9 12.25,41.9 12.15,41.8 12.15,41.7 12.48,41.37 LED2.K
N$27
  Bottom 0.61: 35,41.35 35.81,41.35 35.83,41.37
  Bottom 0.813: R16.1 35.83,41.37
  Bottom 1.93: LED3.K 35,41.35
N$31
  pour Bottom: 0.51,7.72 0.51,12.4 1.02,12.8 5.28,12.8 6.1,11.99 6.1,10.97 6.91,10.26 6.91,7.72 1.83,7.72 1.73,7.72
N$32
  Bottom 0.813: C2.2 C26.2 4.6,54.75 R23.1
N$33
  Bottom 0.61: IC7.2 11.02,57.56 10.75,57.3 R24.1 C27.1 R23.2
N$34  (1 unrouted)
  Bottom 0.61: 10.55,55.5 10.75,55.5 | 11.54,56.3 IC7.1 | C28.1 10.55,53.9
  Bottom 0.813: 10.75,55.5 11.54,56.3 | 10.55,53.9 10.55,55.5 R24.2 C27.2
N$35  (1 unrouted)
  Bottom 0.813: R27.1 C28.2
N$36
  Bottom 0.813: R25.2 U$2.2 3,59.06 C2.1 C26.1
N$37
  Bottom 0.813: IC6.5 R31.2 TP2.P$1
  Bottom 1.778: IC6.5
N$38
  pour Bottom: 0.81,16.15 0.81,27.53 0.61,29.7 3.55,29.85 3.6,16.15
N$39
  Bottom 0.61: 15.26,60.1 13.95,58.8 12.48,58.8 IC7.3 12.41,58.8 | 15.26,60.1 IC7.5 | 15.26,60.1 15.35,60.2
  Bottom 0.813: R29.2 15.35,62.2 | 15.35,62.2 R30.1 | 15.35,60.2 15.35,62.2 | 12.41,58.8 10.95,58.8 10.65,59.1 C33.1 U$2.1 R25.1
N$40  (1 unrouted)
  Bottom 0.61: IC1.24 17.59,24.2 S2.1
N$41
  Bottom 0.61: 19.18,58.84 IC7.6 16.18,58.84
  Bottom 0.813: C31.1 R28.1 19.45,59.1 19.18,58.84 | R27.2 16.15,55.2 15.45,55.9 15.45,58.1 16.18,58.84
N$43
  Bottom 0.813: C34.2 C35.2 43.9,56.6 C1.1 | C34.2 40,57.1 39.63,56.73 IC6.6 | C34.2 41.15,57.05 R32.1 42.44,53.8 R20.3
  Bottom 1.778: IC6.6 38.4,56.75
N$44
  Bottom 0.61: 19.18,57.56 IC7.7
  Bottom 0.813: R28.2 C31.2 22.65,56.36 R19.3 | R28.2 19.45,57.3 19.18,57.56 | TP4.P$1 20.6,57.25 R28.2
N$45
  Bottom 0.813: C32.1 27.25,56.84 R19.2
N$46
  Bottom 0.813: 30.76,56.7 C32.2 TP1.P$1
  Bottom 1.676: IC6.3 30.76,56.7
N$47
  Bottom 0.813: C37.2 IC6.1
  Bottom 1.778: IC6.1
N$48
  Bottom 0.1: 35.6,14.6 35.6,16.9 37.9,16.9 | 37.9,14.6 37.9,16.9 | 37.9,16.9 39.8,16.9
N$49
  Bottom 0.813: C36.2 30.81,59.25 IC6.2
  Bottom 1.778: IC6.2 30.8,59.3
N$56
  Bottom 0.1: 13.45,58.15 10.6,58.15 10.4,58.35 9.1,58.35 8.7,57.95 10.55,57.95
N$57
  Bottom 0.1: 13.5,56.9 11.25,56.9
N$58
  Bottom 0.1: 16.6,56.9 18.7,56.9
N$59
  Bottom 0.1: 16.6,58.15 18.85,58.15 18.9,58.2 16.65,58.2
N$60
  Bottom 0.1: 18.89,59.48 16.61,59.48 16.6,59.47
N$61
  Bottom 0.1: 11.4,59.45 13.7,59.45 14.7,60.45 14.7,61.1 14.45,60.85 14.15,60.85 14.15,60.7 14.3,60.55 14.3,60.5 13.85,60.05 13.85,60.6 13.65,60.8
N$62
  Bottom 0.1: 16.15,57.85 16.15,56.05
N$64
  Bottom 0.1: 7.25,58.1 6.1,58.1 6.05,58.05
N$66
  Bottom 0.1: 22.25,24.2 22.6,24.2 22.65,24.15 22.65,23.6 22.25,24
N$69
  Bottom 0.1: 26.7,14.95 26.55,14.95 26.55,15.3 26.6,15.3 27.35,14.55 27.05,14.55
RESET  (via drill 0.8 pad 1.68, 0.8 pad 1.93)
  Top 0.508: v13.9,14.45 16.45,15.7 18.1,17 24.95,16.85 v28.65,16.9
  Bottom 0.508: 13.11,29.7 11.4,29.7 | 30.4,18.1 31.06,18.1 R7.1
  Bottom 0.61: IC1.29 13.3,29.7 | 13.3,29.7 13.11,29.7 | 9.3,28.7 10.3,29.7 13.29,29.7 13.3,29.7 | 31.14,19.99 31.14,18.79 30.55,18.2 30.55,19.54 U$3.5
  Bottom 0.813: C14.2 11.43,13.02 10.03,14.43 | 10.03,14.43 9.3,15.15 9.3,28.7 | R7.1 31.14,19.99 | 29.5,17.2 30.4,18.1 | v13.9,14.45 10.05,14.45 10.03,14.43
  Bottom 1.016: v28.65,16.9 29.5,17.2
RX  (1 unrouted)
  Bottom 0.61: 16.3,30.5 12.71,30.5 12.7,30.5 9.7,30.5 8.2,29
  Bottom 0.813: SV1.4 10.16,12.74 8.2,14.7 8.2,29
SCK  (via drill 0.8 pad 1.68, 0.8 pad 1.78)
  Top 0.508: v28.3,25 31.4,25 v33.2,26.8
  Bottom 0.49: 27.22,21.28 27.22,24.89
  Bottom 0.508: 28.09,25.01 v28.3,25 | 36.4,26.8 U$4.5 | U$3.3 28.53,20.07 | 27.22,24.89 27.2,25.01
  Bottom 0.61: IC1.17 27.2,25.01 | 28.53,20.07 27.22,21.28
  Bottom 0.813: 27.2,25.01 28.09,25.01
  Bottom 1.27: v33.2,26.8 36.4,26.8
TX
  Bottom 0.61: IC1.31 12.21,31.3 12.2,31.3 9,31.3 7.1,29.4 | SV1.5 12.7,1.2 12.2,0.7 9.3,0.7 8.9,1.1 8.9,3.9 8.95,3.95 8.95,4.1 8.9,4.15
  Bottom 0.813: 8.9,4.15 8.9,12.4 7.1,14.2 7.1,29.4
US_INT  (via drill 0.6 pad 1.68)
  Top 0.61: v28.5,50.3 v29.85,44.4
  Bottom 0.61: IC1.1 18.41,36.09 13.8,40.7 13.8,42.1 | 33,55.45 30,55.45 | TP3.P$1
  Bottom 0.813: 13.8,42.1 16.45,44.75 28.25,44.75 v29.85,44.4 | 33,55.45 36.31,58.76 36.31,61.81 IC6.8 TP3.P$1 | 30,55.45 28.5,53.95 v28.5,50.3
  Bottom 1.778: IC6.8
V+
  Bottom 0.508: D4.C 22.8,13.9 22.8,16.1 19.98,18.92 R8.2
  Bottom 0.813: D4.C 20.57,13.8 C18.+
  Bottom 1.27: D4.C 23.09,13.41 IC4.1 23.2,9.05 23.2,2.55
  Bottom 1.422: S1.3 23.2,2.55 S1.2
VCC
  Bottom 0.508: IC1.4 20.8,32.24 21.15,31.9 22.41,31.9 | IC1.6 22.41,32.41 | IC1.18 | 23.2,20.88 C20.2 | 23.2,22.6
  Bottom 0.61: IC1.18 23.2,30.48 22.41,31.28 22.41,31.9 22.41,32.41 | IC1.18 23.2,22.6 23.2,20.88 | U$3.2 23.2,22.6 | 23.7,19.1 23.04,19.77 C20.2 | 7.3,45.2 7.09,45.19 6.64,45.16 | R14.2 3.5,43.05 3.15,43.4 R1.2
  Bottom 0.813: 28.17,14.63 23.7,19.1 | 7.38,45.2 6.64,45.16 R14.2 | R7.2 31.14,15.5 31.21,15.43 | C16.+ 32.46,15.39 32.4,15.46 | C19.1 28.14,11.67 28.17,11.7 | 7.3,45.2 7.3,31.2 5.9,29.8 5.9,13.6 7.6,11.9 7.6,2.56 SV1.3 | R26.1 18.95,46.95 | R21.2 30.7,47.05 30.8,46.95 | 9.8,46.95 9.8,46.9
  Bottom 1.27: IC4.3 28.17,11.7 28.17,13.7 | 28.17,13.7 28.17,14.63 | D4.A 26.2,13.7 28.17,13.7 | 28.17,13.7 29.77,15.4 31.21,15.43 32.4,15.46 IC5.3 34.5,15.74 34.5,17.9 40.3,17.9 44.3,21.7 44.3,39.2 36.55,46.95 30.8,46.95 18.95,46.95 9.8,46.95 | 9.8,46.9 8.09,45.19 7.09,45.19
(copper drawn outside any net)
  shapes: Bottom circle x1

### Text on the board
bRestrict: Alex Blum | IPS | 06/14